# Altium schematic sheet 09_MCU.SchDoc
size 594 x 420 mm; DocumentNumber: ATmega64A-AU; SheetNumber: 9; SheetTotal: 11
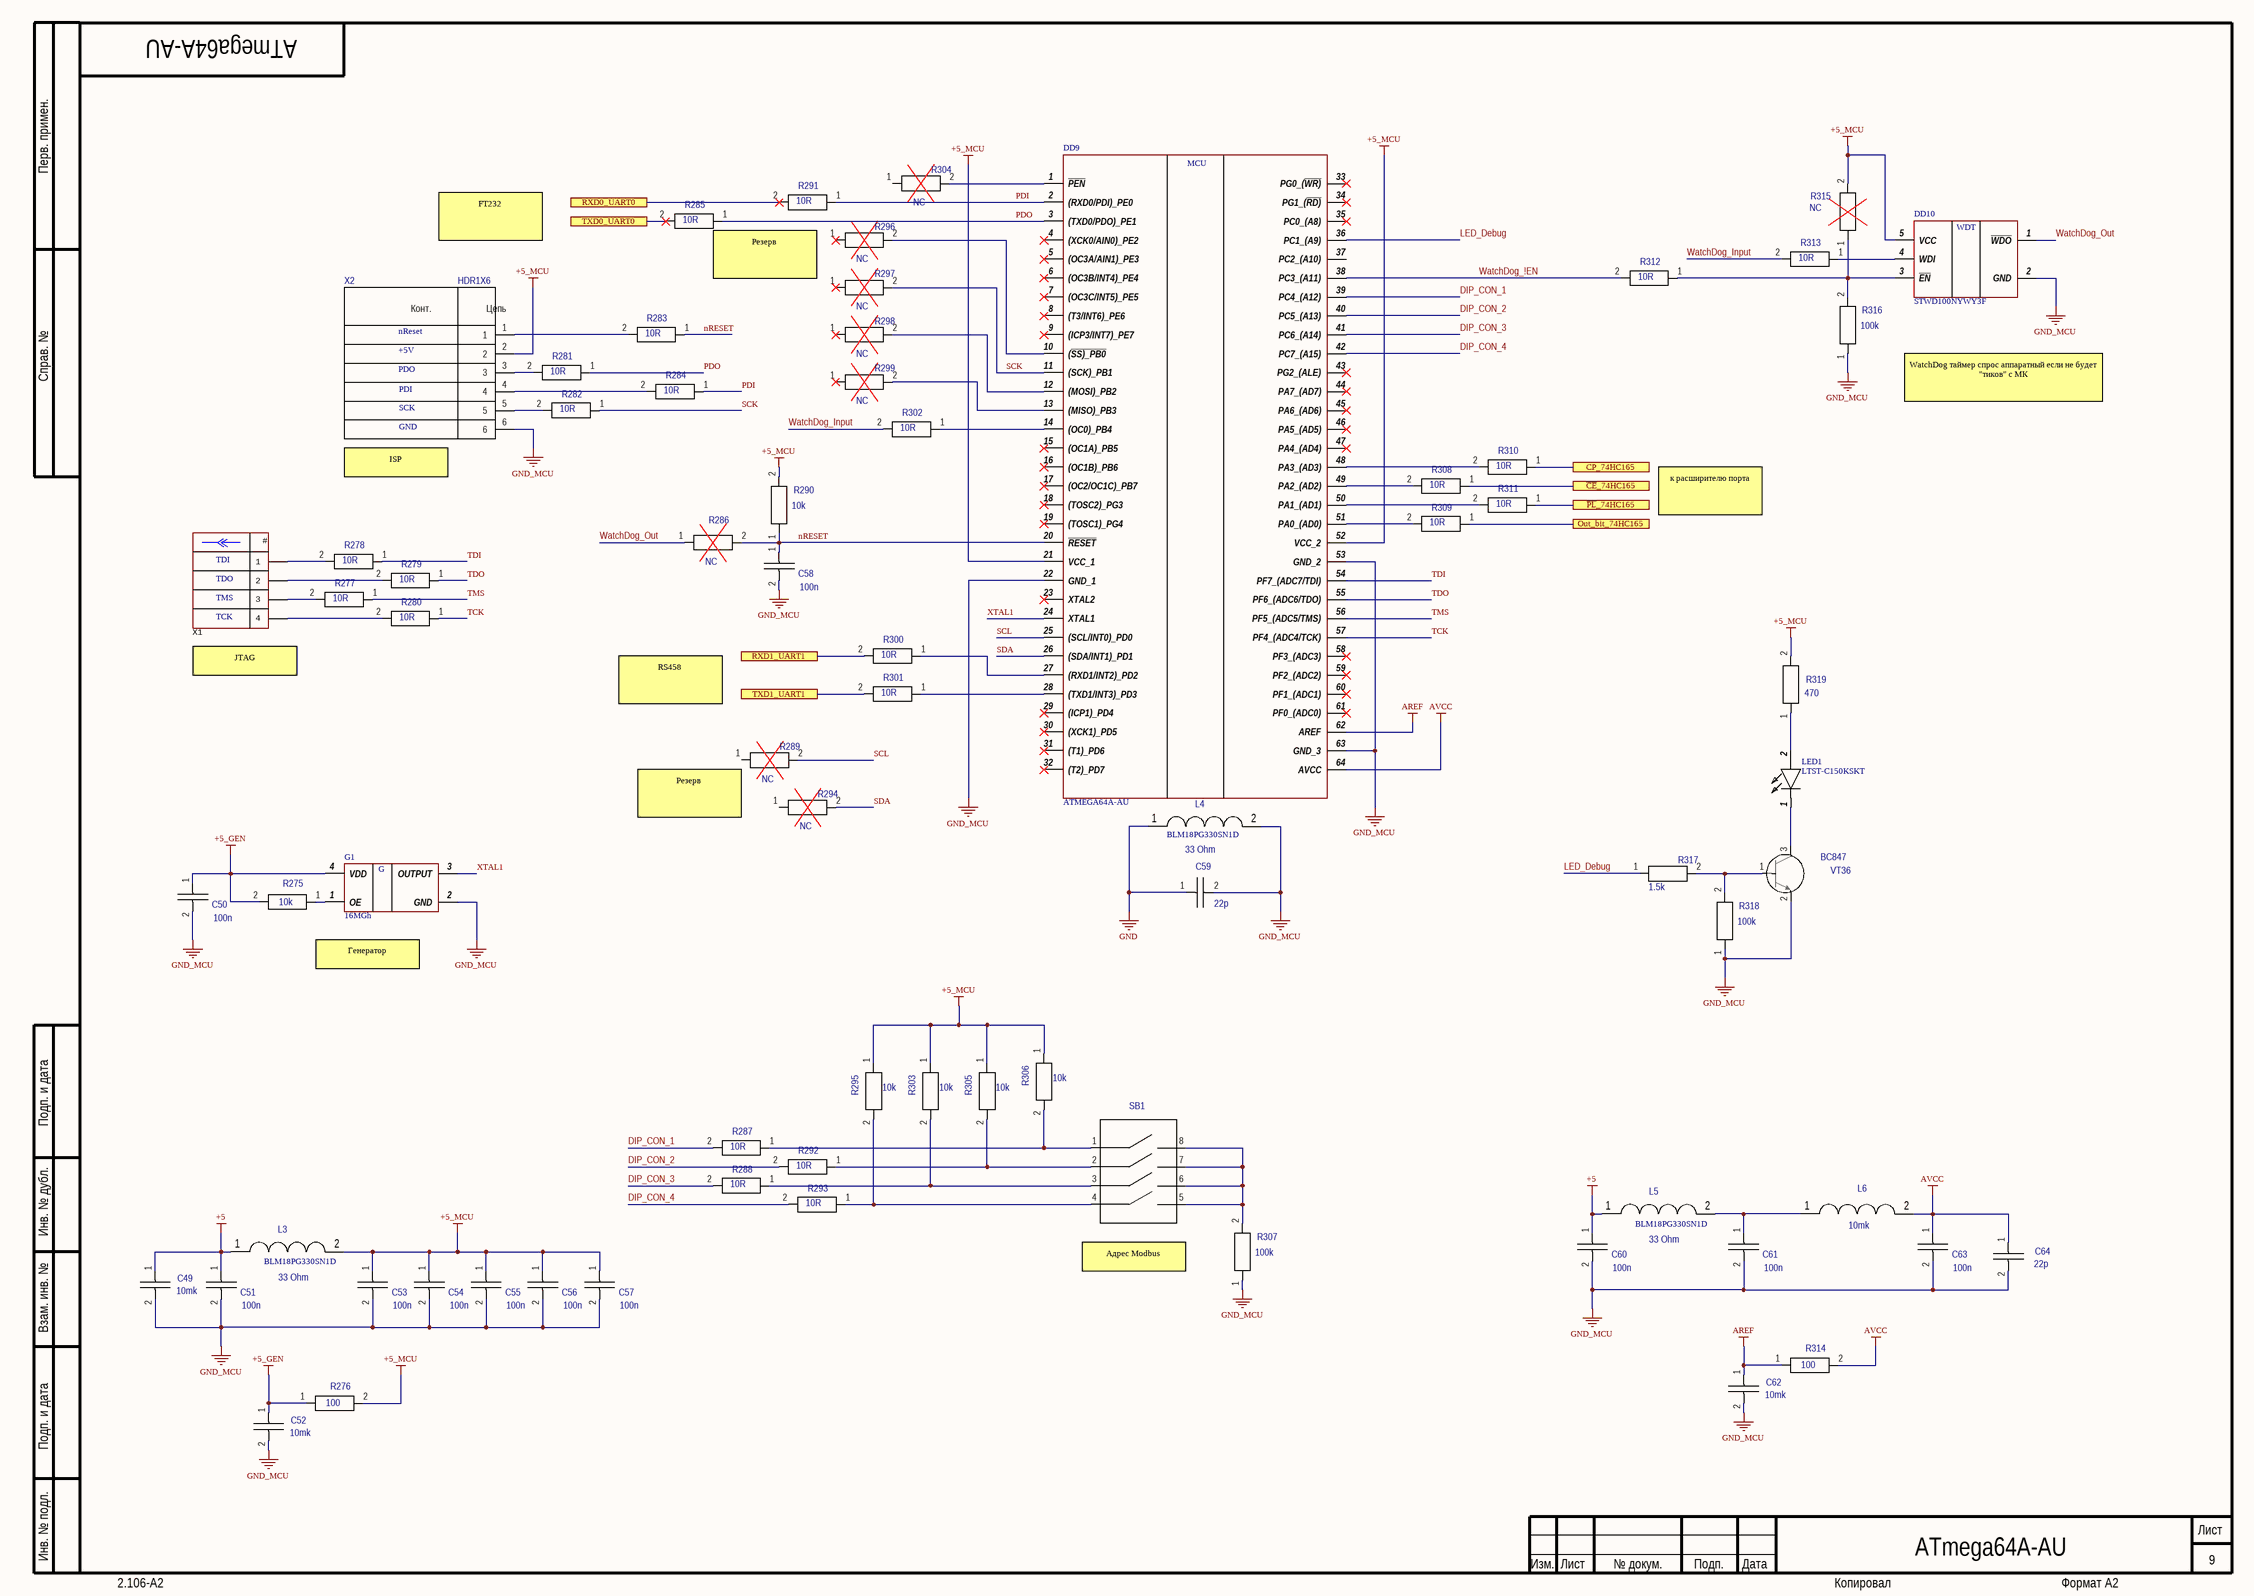
[diagram p0: 09_MCU.SchDoc]

## Parts
C49  value 10mk  [C1206]  (hidden comment: C1206)
C50  value 100n  [C0603]  (hidden comment: C0603)
C51  value 100n  [C0603]  (hidden comment: C0603)
C52  value 10mk  [C1206]  (hidden comment: C1206)
C53  value 100n  [C0603]  (hidden comment: C0603)
C54  value 100n  [C0603]  (hidden comment: C0603)
C55  value 100n  [C0603]  (hidden comment: C0603)
C56  value 100n  [C0603]  (hidden comment: C0603)
C57  value 100n  [C0603]  (hidden comment: C0603)
C58  value 100n  [C0603]  (hidden comment: C0603)
C59  value 22p  [C0603]  (hidden comment: C0603)
C60  value 100n  [C0603]  (hidden comment: C0603)
C61  value 100n  [C0603]  (hidden comment: C0603)
C62  value 10mk  [C1206]  (hidden comment: C1206)
C63  value 100n  [C0603]  (hidden comment: C0603)
C64  value 22p  [C0603]  (hidden comment: C0603)
DD9  ATMEGA64A-AU  [QFP80P1600X1600X120-64N]
DD10  STWD100NYWY3F  [SOT95P280X145-5N]
G1  16MGh  [CSX750FBC14745600T]
L3  BLM18PG330SN1D  value 33 Ohm  [INDC1608N]
L4  BLM18PG330SN1D  value 33 Ohm  [INDC1608N]
L5  BLM18PG330SN1D  value 33 Ohm  [INDC1608N]
L6  value 10mk  [INDC4532AN]  (hidden comment: L1812)
LED1  LTST-C150KSKT  [LEDC3216X110N]
R275  value 10k  [RESC1608N]  (hidden comment: R0603)
R276  value 100  [RESC1608N]  (hidden comment: R0603)
R277  value 10R  [RESC1608N]  (hidden comment: R0603)
R278  value 10R  [RESC1608N]  (hidden comment: R0603)
R279  value 10R  [RESC1608N]  (hidden comment: R0603)
R280  value 10R  [RESC1608N]  (hidden comment: R0603)
R281  value 10R  [RESC1608N]  (hidden comment: R0603)
R282  value 10R  [RESC1608N]  (hidden comment: R0603)
R283  value 10R  [RESC1608N]  (hidden comment: R0603)
R284  value 10R  [RESC1608N]  (hidden comment: R0603)
R285  value 10R  [RESC1608N]  (hidden comment: R0603)
R286  value NC  [RESC1608N]  (hidden comment: R0603)
R287  value 10R  [RESC1608N]  (hidden comment: R0603)
R288  value 10R  [RESC1608N]  (hidden comment: R0603)
R289  value NC  [RESC1608N]  (hidden comment: R0603)
R290  value 10k  [RESC1608N]  (hidden comment: R0603)
R291  value 10R  [RESC1608N]  (hidden comment: R0603)
R292  value 10R  [RESC1608N]  (hidden comment: R0603)
R293  value 10R  [RESC1608N]  (hidden comment: R0603)
R294  value NC  [RESC1608N]  (hidden comment: R0603)
R295  value 10k  [RESC1608N]  (hidden comment: R0603)
R296  value NC  [RESC1608N]  (hidden comment: R0603)
R297  value NC  [RESC1608N]  (hidden comment: R0603)
R298  value NC  [RESC1608N]  (hidden comment: R0603)
R299  value NC  [RESC1608N]  (hidden comment: R0603)
R300  value 10R  [RESC1608N]  (hidden comment: R0603)
R301  value 10R  [RESC1608N]  (hidden comment: R0603)
R302  value 10R  [RESC1608N]  (hidden comment: R0603)
R303  value 10k  [RESC1608N]  (hidden comment: R0603)
R304  value NC  [RESC1608N]  (hidden comment: R0603)
R305  value 10k  [RESC1608N]  (hidden comment: R0603)
R306  value 10k  [RESC1608N]  (hidden comment: R0603)
R307  value 100k  [RESC1608N]  (hidden comment: R0603)
R308  value 10R  [RESC1608N]  (hidden comment: R0603)
R309  value 10R  [RESC1608N]  (hidden comment: R0603)
R310  value 10R  [RESC1608N]  (hidden comment: R0603)
R311  value 10R  [RESC1608N]  (hidden comment: R0603)
R312  value 10R  [RESC1608N]  (hidden comment: R0603)
R313  value 10R  [RESC1608N]  (hidden comment: R0603)
R314  value 100  [RESC1608N]  (hidden comment: R0603)
R315  value NC  [RESC1608N]  (hidden comment: R0603)
R316  value 100k  [RESC1608N]  (hidden comment: R0603)
R317  value 1.5k  [RESC1608N]  (hidden comment: R0603)
R318  value 100k  [RESC1608N]  (hidden comment: R0603)
R319  value 470  [RESC1608N]  (hidden comment: R0603)
SB1  DS1040-04RN  [Dip_4pin]  (value not drawn)
VT36  BC847  [SOT23-3N]
X1  (no value)  [CON: PBS-4]
X2  HDR1X6  [HDR1X6]

## Ports
CP_74HC165, Out_bit_74HC165, RXD0_UART0, RXD1_UART1, TXD0_UART0, TXD1_UART1, ~{CE}_74HC165, ~{PL}_74HC165

## Nets
+5: C49.1 C51.1 C60.1 L3.1 L5.1
+5_GEN: C50.1 C52.1 G1.4(VDD) R275.2 R276.1
+5_MCU: C53.1 C54.1 C55.1 C56.1 C57.1 DD9.21(VCC_1) DD9.52(VCC_2) DD10.5(VCC) L3.2 R276.2 R290.2 R295.1 R303.1 R305.1 R306.1 R315.2 R319.2 X2.2
AREF: C62.1 DD9.62(AREF) R314.1
AVCC: C63.1 C64.1 DD9.64(AVCC) L6.2 R314.2
GND: C59.1 L4.1
GND_MCU: C49.2 C50.2 C51.2 C52.2 C53.2 C54.2 C55.2 C56.2 C57.2 C58.2 C59.2 C60.2 C61.2 C62.2 C63.2 C64.2 DD9.22(GND_1) DD9.53(GND_2) DD9.63(GND_3) DD10.2(GND) G1.2(GND) L4.2 R307.1 R316.1 R318.1 VT36.2 X2.6
~{CE}_74HC165: R308.1 ; port ~{CE}_74HC165
~{PL}_74HC165: R311.1 ; port ~{PL}_74HC165
CP_74HC165: R310.1 ; port CP_74HC165
DIP_CON_1: DD9.39(PC4_(A12)) R287.2
DIP_CON_2: DD9.40(PC5_(A13)) R292.2
DIP_CON_3: DD9.41(PC6_(A14)) R288.2
DIP_CON_4: DD9.42(PC7_(A15)) R293.2
LED_Debug: DD9.36(PC1_(A9)) R317.1
nRESET: C58.1 DD9.20(~{RESET}) R283.1 R286.2 R290.1
Out_bit_74HC165: R309.1 ; port Out_bit_74HC165
PDI: DD9.2((RXD0/PDI)_PE0) R284.1 R291.1
PDO: DD9.3((TXD0/PDO)_PE1) R281.1 R285.1
RXD0_UART0: R291.2 ; port RXD0_UART0
RXD1_UART1: R300.2 ; port RXD1_UART1
SCK: DD9.11((SCK)_PB1) R282.1 R297.2
SCL: DD9.25((SCL/INT0)_PD0) R289.2
SDA: DD9.26((SDA/INT1)_PD1) R294.2
TCK: DD9.57(PF4_(ADC4/TCK)) R280.1
TDI: DD9.54(PF7_(ADC7/TDI)) R278.1
TDO: DD9.55(PF6_(ADC6/TDO)) R279.1
TMS: DD9.56(PF5_(ADC5/TMS)) R277.1
TXD0_UART0: R285.2 ; port TXD0_UART0
TXD1_UART1: R301.2 ; port TXD1_UART1
WatchDog_!EN: DD9.38(PC3_(A11)) R312.2
WatchDog_Input: R302.2 R313.2
WatchDog_Out: DD10.1(~{WDO}) R286.1
XTAL1: DD9.24(XTAL1) G1.3(OUTPUT)
NetC61_1: C61.1 L5.2 L6.1
NetDD9_1: DD9.1(~{PEN}) R304.2
NetDD9_10: DD9.10((~{SS)_PB0}) R296.2
NetDD9_12: DD9.12((MOSI)_PB2) R298.2
NetDD9_13: DD9.13((MISO)_PB3) R299.2
NetDD9_14: DD9.14((OC0)_PB4) R302.1
NetDD9_27: DD9.27((RXD1/INT2)_PD2) R300.1
NetDD9_28: DD9.28((TXD1/INT3)_PD3) R301.1
NetDD9_48: DD9.48(PA3_(AD3)) R310.2
NetDD9_49: DD9.49(PA2_(AD2)) R308.2
NetDD9_50: DD9.50(PA1_(AD1)) R311.2
NetDD9_51: DD9.51(PA0_(AD0)) R309.2
NetDD10_3: DD10.3(~{EN}) R312.1 R315.1 R316.2
NetDD10_4: DD10.4(WDI) R313.1
NetG1_1: G1.1(OE) R275.1
NetLED1_1: LED1.1(K) VT36.3
NetLED1_2: LED1.2(A) R319.1
NetR277_2: R277.2 X1.3
NetR278_2: R278.2 X1.1
NetR279_2: R279.2 X1.2
NetR280_2: R280.2 X1.4
NetR281_2: R281.2 X2.3
NetR282_2: R282.2 X2.5
NetR283_2: R283.2 X2.1
NetR284_2: R284.2 X2.4
NetR287_1: R287.1 R306.2 SB1.1
NetR288_1: R288.1 R303.2 SB1.3
NetR292_1: R292.1 R305.2 SB1.2
NetR293_1: R293.1 R295.2 SB1.4
NetR307_2: R307.2 SB1.5 SB1.6 SB1.7 SB1.8
NetR317_2: R317.2 R318.2 VT36.1

Not connected (* = marked no-connect by the designer): DD9 4((XCK0/AIN0)_PE2)* 5((OC3A/AIN1)_PE3)* 6((OC3B/INT4)_PE4)* 7((OC3C/INT5)_PE5)* 8((T3/INT6)_PE6)* 9((ICP3/INT7)_PE7)* 15((OC1A)_PB5)* 16((OC1B)_PB6)* 17((OC2/OC1C)_PB7)* 18((TOSC2)_PG3)* 19((TOSC1)_PG4)* 23(XTAL2)* 29((ICP1)_PD4)* 30((XCK1)_PD5)* 31((T1)_PD6)* 32((T2)_PD7)* 33(PG0_(~{WR)})* 34(PG1_(~{RD)})* 35(PC0_(A8))* 37(PC2_(A10)) 43(PG2_(ALE))* 44(PA7_(AD7))* 45(PA6_(AD6))* 46(PA5_(AD5))* 47(PA4_(AD4))* 58(PF3_(ADC3))* 59(PF2_(ADC2))* 60(PF1_(ADC1))* 61(PF0_(ADC0))*; R289 1; R294 1; R296 1*; R297 1*; R298 1*; R299 1*; R304 1

## Notes on the sheet
- FT232
- (near R285) Резерв
- nReset
- +5V
- PDO
- SCK
- PDI
- WatchDog таймер спрос аппаратный если не будет "тиков" с МК
- GND
- ISP
- к расширителю порта
- TDI
- TDO
- TMS
- TCK
- (near X1) JTAG
- RS458
- (near R289) Резерв
- Генератор
- Адрес Modbus
- Перв. примен.
- Справ. №
- Подп. и дата
- Инв. № дубл.
- Взам. инв. №
- Инв. № подл.
- Изм.
- Лист
- № докум.
- Подп.
- Дата
- 2.106-A2
- Копировал
- Формат А2
- (in symbol ATMEGA64A-AU) MCU
- (in symbol CSX-750FCC) G
- (in symbol HDR1X6) Конт.; Цепь
- (in symbol PBS-4) #
- (in symbol STWD100NYWY3F) WDT

## Library data of the parts
C49 C52 C62 = GRM31CR71E106KA12L: Manufacturer: Murata Manufacturing; Код: 62; ID: Конденсатор; Power/Voltage: 25V; Tolerance: ±10%; TKE: X7R; iii: Конденсатор GRM31CR71E106KA12L 10mk 25V ±10% C1206 X7R  Murata Manufacturing; Comments: C1206; Part Number: GRM31CR71E106KA12L; Height: 1,5; Package: C1206; TemperatureMin: -55; TemperatureMax: 125
C50 C51 C53-C58 C60 C61 C63 = GRM188R71C104KA01D: Manufacturer: Murata Manufacturing; Код: 22; ID: Конденсатор; Power/Voltage: 16V; Tolerance: ±10%; TKE: X7R; iii: Конденсатор GRM188R71C104KA01D 100n 16V ±10% C0603 X7R  Murata Manufacturing; Comments: C0603; Part Number: GRM188R71C104KA01D; Height: 0.9; Package: C0603; TemperatureMin: -55; TemperatureMax: 125
C59 C64 = GRM1885C1H220JA01D: Manufacturer: Murata Manufacturing; Код: 80; ID: Конденсатор; Power/Voltage: 50V; Tolerance: ±5%; TKE: c0g; iii: Конденсатор GRM1885C1H220JA01D 22p 50V ±5% C0603 c0g Murata Manufacturing; Comments: C0603; Part Number: GRM1885C1H220JA01D; Package: C0603; TemperatureMin: -55; TemperatureMax: 125
DD9 = ATMEGA64A-AU: Integrated Circuit; Manufacturer_Name: Microchip; Datasheet Link: https://datasheet.datasheetarchive.com/originals/distributors/Datasheets_SAMA/61cd3663d987104d1956c12d3ceac457.pdf; Height: 1.2mm; Manufacturer_Part_Number: ATMEGA64A-AU; Mouser Part Number: 556-ATMEGA64A-AU; Mouser Price/Stock: https://www.mouser.co.uk/ProductDetail/Microchip-Technology-Atmel/ATMEGA64A-AU?qs=RwPDB89%252B8xSA448I6y2Ecg%3D%3D; Part Number: ATMEGA64A-AU; Arrow Price/Stock: https://www.arrow.com/en/products/atmega64a-au/microchip-technology?region=nac
DD10 = STWD100NYWY3F: Integrated Circuit; Manufacturer_Name: STMicroelectronics; Datasheet Link: https://datasheet.datasheetarchive.com/originals/distributors/Datasheets-DGA25/1683135.pdf; Height: 1.45mm; PartNumber: STWD100NYWY3F; Mouser Part Number: 511-STWD100NYWY3F; Mouser Price/Stock: https://www.mouser.co.uk/ProductDetail/STMicroelectronics/STWD100NYWY3F?qs=jWm4idrLpzx15dHtESXwMQ%3D%3D; Arrow Part Number: STWD100NYWY3F; Arrow Price/Stock: https://www.arrow.com/en/products/stwd100nywy3f/stmicroelectronics?region=nac
G1 = CSX-750FCC: Кварцевый генератор 16МГц 5В,HCMOS/TTL в корпусе SMD 7x5мм; гк 16000 \\SMD07050C4\T/CM\5В\ CSX-750FCC\CITIZEN; Manufacturer_Name: Citizen Finetech Miyota; Datasheet Link: https://www.chipdip.ru/product0/8004482821; Height: 1.6mm; Manufacturer_Part_Number: CSX-750FCC; PartNumber: CSX-750FCC; Mouser Price/Stock: https://www.chipdip.ru/product0/8004482821
L3-L5 = BLM18PG330SN1D: Код: 22; ID: Ферритовая бусина; Power/Voltage: 3A; iii: Ферритовая бусина BLM18PG330SN1D 33 Ohm 3A  L0603; Com: BLM18PG330SN1D; Part Number: BLM18PG330SN1D; Package: L0603
L6 = B82432-A1103-K: Manufacturer: Epcos; Код: 16; ID: Индуктивность; Tolerance: ±10%; iii: Индуктивность B82432-A1103-K 10mk  ±10% L1812  Epcos; Com: L1812; Part Number: B82432-A1103-K; Package: L1812
LED1 = LTST-C150KSKT: LED; Manufacturer_Name: Lite-On; Datasheet Link: https://componentsearchengine.com/Datasheets/1/LTST-C150KSKT.pdf; Height: 1.1mm; Manufacturer_Part_Number: LTST-C150KSKT; Mouser Part Number: 859-LTST-C150KSKT; Mouser Price/Stock: https://www.mouser.co.uk/ProductDetail/Lite-On/LTST-C150KSKT?qs=BwFLjhzUaKkzXUKRSgwLjg%3D%3D; Arrow Part Number: LTST-C150KSKT; Arrow Price/Stock: https://www.arrow.com/en/products/ltst-c150kskt/lite-on-technology?region=nac
R275 R290 R295 R303 R305 R306 = RC0603FK-0710KL: Manufacturer: Тайвань; Код: 26; ID: Резистор; Power/Voltage: 0.063W/50V; Tolerance: ±1%; iii: Резистор RC0603FK-0710KL 10k 0.063W/50V ±1% R0603  Тайвань; Comments: R0603; Part Number: RC0603FK-0710KL; Package: R0603; TemperatureMin: -55; TemperatureMax: 155
R276 R314 = RC0603FK-07100RL: Manufacturer: Тайвань; Код: 16; ID: Резистор; Power/Voltage: 0.063W/50V; Tolerance: ±1%; iii: Резистор RC0603FK-07100RL 100 0.063W/50V ±1% R0603  Тайвань; Comments: R0603; Part Number: RC0603FK-07100RL; Package: R0603; TemperatureMin: -55; TemperatureMax: 155
R277-R285 R287 R288 R291-R293 R300-R302 R308-R313 = RC0603FK-0710KL: Part Number: RC0603FR-0710RL; Manufacturer: Тайвань; Код: 26; ID: Резистор; Power/Voltage: 0.063W/50V; Tolerance: ±1%; iii: Резистор RC0603FK-0710KL 10k 0.063W/50V ±1% R0603  Тайвань; Comments: R0603; Package: R0603; TemperatureMin: -55; TemperatureMax: 155
R286 R289 R294 R296-R299 R304 R315 = 0603_NC: Код: 274; iii: NC 0603_NC NC   R0603; Comments: R0603; ID: NC; Part Number: 0603_NC; Package: R0603
R307 R316 R318 = RC0603FK-07100KL: Manufacturer: Тайвань; Код: 24; ID: Резистор; Power/Voltage: 0.063W/50V; Tolerance: ±1%; iii: Резистор RC0603FK-07100KL 100k 0.063W/50V ±1% R0603  Тайвань; Comments: R0603; Part Number: RC0603FK-07100KL; Package: R0603; TemperatureMin: -55; TemperatureMax: 155
R317 = RC0603FK-071K5L: Manufacturer: Тайвань; Код: 22; ID: Резистор; Power/Voltage: 0.063W/50V; Tolerance: ±1%; iii: Резистор RC0603FK-071K5L 1.5k 0.063W/50V ±1% R0603  Тайвань; Comments: R0603; Part Number: RC0603FK-071K5L; Package: R0603; TemperatureMin: -55; TemperatureMax: 155
R319 = RC0603FK-07470RL: Manufacturer: Тайвань; Код: 20; ID: Резистор; Power/Voltage: 0.063W/50V; Tolerance: ±1%; iii: Резистор RC0603FK-07470RL 470 0.063W/50V ±1% R0603  Тайвань; Comments: R0603; Part Number: RC0603FK-07470RL; Package: R0603; TemperatureMin: -55; TemperatureMax: 155
SB1 = DS1040-04RN: Код: 51; ID: Переключатель DIP; iii: Переключатель DIP DS1040-04RN; Part Number: DS1040-04RN
VT36 = BC847: Manufacturer: NXP Semiconductor; Код: 2; ID: Транзистор; Value: 0.1A; Power/Voltage: 45V; iii: Транзистор BC847 0.1A 45V  sot23  NXP Semiconductor; Com: BC847; Part Number: BC847; Package: sot23
X1 = PBS-4: Manufacturer: Connfly; ValueManufacturerPartNumber: Connector, 4pin, 2.54mm, 500VAC, 3A; TypeConnector: Connector; VoltageMax: 500VAC; Pitch: 2.54mm; CurrentMax: 3A; Multichannel: 4pin; CommentText: "Разъем"; HelpURL: https://www.chipdip.ru/product/pbs-4; PartNumber: PBS-4
X2 = HDR1X6: Manufacturer: Dinkle Enterprise; Код: 13; ID: Коннектор; iii: Коннектор HDR1X6      Dinkle Enterprise; Part Number: HDR1X6